# Altium schematic sheet AP62500_6V.SchDoc
size A4; SheetNumber: 4; SheetTotal: 27
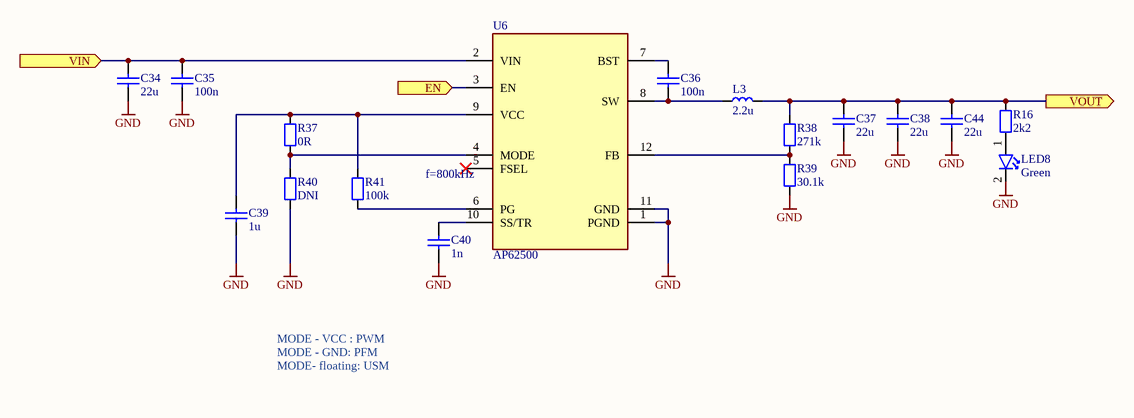
[diagram p0: AP62500_6V.SchDoc]

## Parts
C34  22u  [C_1206_3216Metric_IPC_N]
C35  100n  [C_0603_1608Metric_IPC_N]
C36  100n  [C_0402_1005Metric_IPC_N]
C37  22u  [C_1206_3216Metric_IPC_N]
C38  22u  [C_1206_3216Metric_IPC_N]
C39  1u  [C_0603_1608Metric_IPC_N]
C40  1n  [C_0402_1005Metric_IPC_N]
C44  22u  [C_1206_3216Metric_IPC_N]
L3  2.2u  [AVX_LMLP07A7]
LED8  Green  [LED_0603_1806Metric_IPC_N]
R16  2k2  [R_0402_1005Metric_IPC_N]
R37  0R  [R_0402_1005Metric_IPC_N]
R38  271k  [R_0402_1005Metric_IPC_N]
R39  30.1k  [R_0402_1005Metric_IPC_N]
R40  DNI  [R_0402_1005Metric_IPC_N]
R41  100k  [R_0402_1005Metric_IPC_N]
U6  AP62500  [V-QFN2030-12-Type-A_3.05x2.05mm_P0.5mm]

## Ports
EN (in, see Power_Supply[3B]), VIN (in, see Power_Supply[3B], AP62500_4V[1B], TPS61377_16V[1B]), VOUT (out, see Power_Supply[3B])

## Nets
GND: C34.1 C35.1 C37.1 C38.1 C39.1 C40.1 C44.1 LED8.2 R39.1 R40.1 U6.1(PGND) U6.11(GND)
EN: U6.3(EN) ; port EN
VIN: C34.2 C35.2 U6.2(VIN) ; port VIN
VOUT: C37.2 C38.2 C44.2 L3.2 R16.1 R38.2 ; port VOUT
NetC36_1: C36.1 L3.1 U6.8(SW)
NetC36_2: C36.2 U6.7(BST)
NetC39_2: C39.2 R37.2 R41.2 U6.9(VCC)
NetC40_2: C40.2 U6.10(SS/TR)
NetLED8_1: LED8.1 R16.2
NetR37_1: R37.1 R40.2 U6.4(MODE)
NetR38_1: R38.1 R39.2 U6.12(FB)
NetR41_1: R41.1 U6.6(PG)

Not connected (* = marked no-connect by the designer): U6 5(FSEL)*

## Notes on the sheet
- (near U6) f=800kHz
- MODE - VCC : PWM
  MODE - GND: PFM
  MODE- floating: USM

## Library data of the parts
C34 C37 C38 C44 = C000005: Generic MLCC with 1206 Footprint; Specific Component: False; ID: C000005; Capacitance: 22u; Tolerance: *; Temp Coefficient: *; Voltage Rated: *; min Temperature: *; max Temperature: *; Case: 1206
C35 C39 = C000003: Generic MLCC with 0603 Footprint; Specific Component: False; ID: C000003; Tolerance: *; Temp Coefficient: *; Voltage Rated: *; min Temperature: *; max Temperature: *; Case: 0603
  C35: Capacitance: 100n
  C39: Capacitance: 1u; Supplier 1: Mouser; Supplier Part Number 1: 81-GRM185R61E105KA2D
C36 C40 = C000002: Generic MLCC with 0402 Footprint; Specific Component: False; ID: C000002; Tolerance: *; Temp Coefficient: *; Voltage Rated: *; min Temperature: *; max Temperature: *; Case: 0402
  C36: Capacitance: 100n; Supplier 1: Digikey; Supplier Part Number 1: 1292-1176-1-ND
  C40: Capacitance: 1n; Supplier 1: Mouser; Supplier Part Number 1: 81-GRM1555C2A102GE1D
L3 = L000012: Power Inductor, 2.2u, 8A, -, 20m, 20%, LMLP07A7; Manufacturer: Kyocera/AVX; Manufacturer Part Number: LMLP07A7M2R2DTAS; Current - Saturation: 12A; min Temperature: -55; max Temperature: +155; ID: L000012; Type: Power Inductor; Inductance: 2.2u; Tolerance: 20%; Current Rating: 8A; DC resistance: 20m; Q @ Freq: -; Case: LMLP07A7; ComponentLink1Description: Datasheet; ComponentLink1URL: https://datasheets.kyocera-avx.com/LMLPD.pdf; Supplier 1: Digikey; Supplier Part Number 1: 478-LMLP07A7M2R2DTASCT-ND; Supplier 2: Mouser; Supplier Part Number 2: 581-LMLP07A7M2R2DTAS
LED8 = LED000007: MLCC, Low Current, Green, 2.2V, 20mA, 0603; Manufacturer: Broadcom / Avago; Manufacturer Part Number: HSMG-C190; Specific Component: True; ID: LED000007; Type: Low Current; Colour: Green; Forward Voltage: 2.2V; Current: 20mA; Case: 0603; ComponentLink1Description: Datasheet; ComponentLink1URL: https://www.mouser.de/datasheet/3/57/1/AV02_0551EN_DS_HSMx_Cxxx_25Mar2022.pdf; Supplier 1: Mouser; Supplier Part Number 1: 630-HSMG-C190; Supplier 2: Digikey; Supplier Part Number 2: 516-1425-1-ND
R16 R37-R41 = R000002: Generic Chip Resistor with 0402 Footprint; Specific Component: False; ID: R000002; Tolerance: *; Power Rating: *; Composition: *; min Temperature: *; max Temperature: *; Temp Coefficient: *; Case: 0402
  R16: Resistance: 2k2
  R37: Resistance: 0R
  R38: Resistance: 271k
  R39: Resistance: 30.1k
  R40: Resistance: DNI
  R41: Resistance: 100k
U6 = PMIC000004: Manufacturer: Diodes Incorporated; ID: PMIC000004; Type: DC/DC; Manufacturer Part Number: AP62500; Part Value: AP62500; Case: V-QFN2030-12 (Type A); ComponentLink1Description: Datasheet; ComponentLink1URL: https://www.diodes.com/assets/Datasheets/AP62500.pdf; Supplier 1: Digikey; Supplier Part Number 1: 31-AP62500SJ-7CT-ND; Supplier 2: Mouser; Supplier Part Number 2: 621-AP62500SJ-7